# Altium project Driverkort.PrjPcb
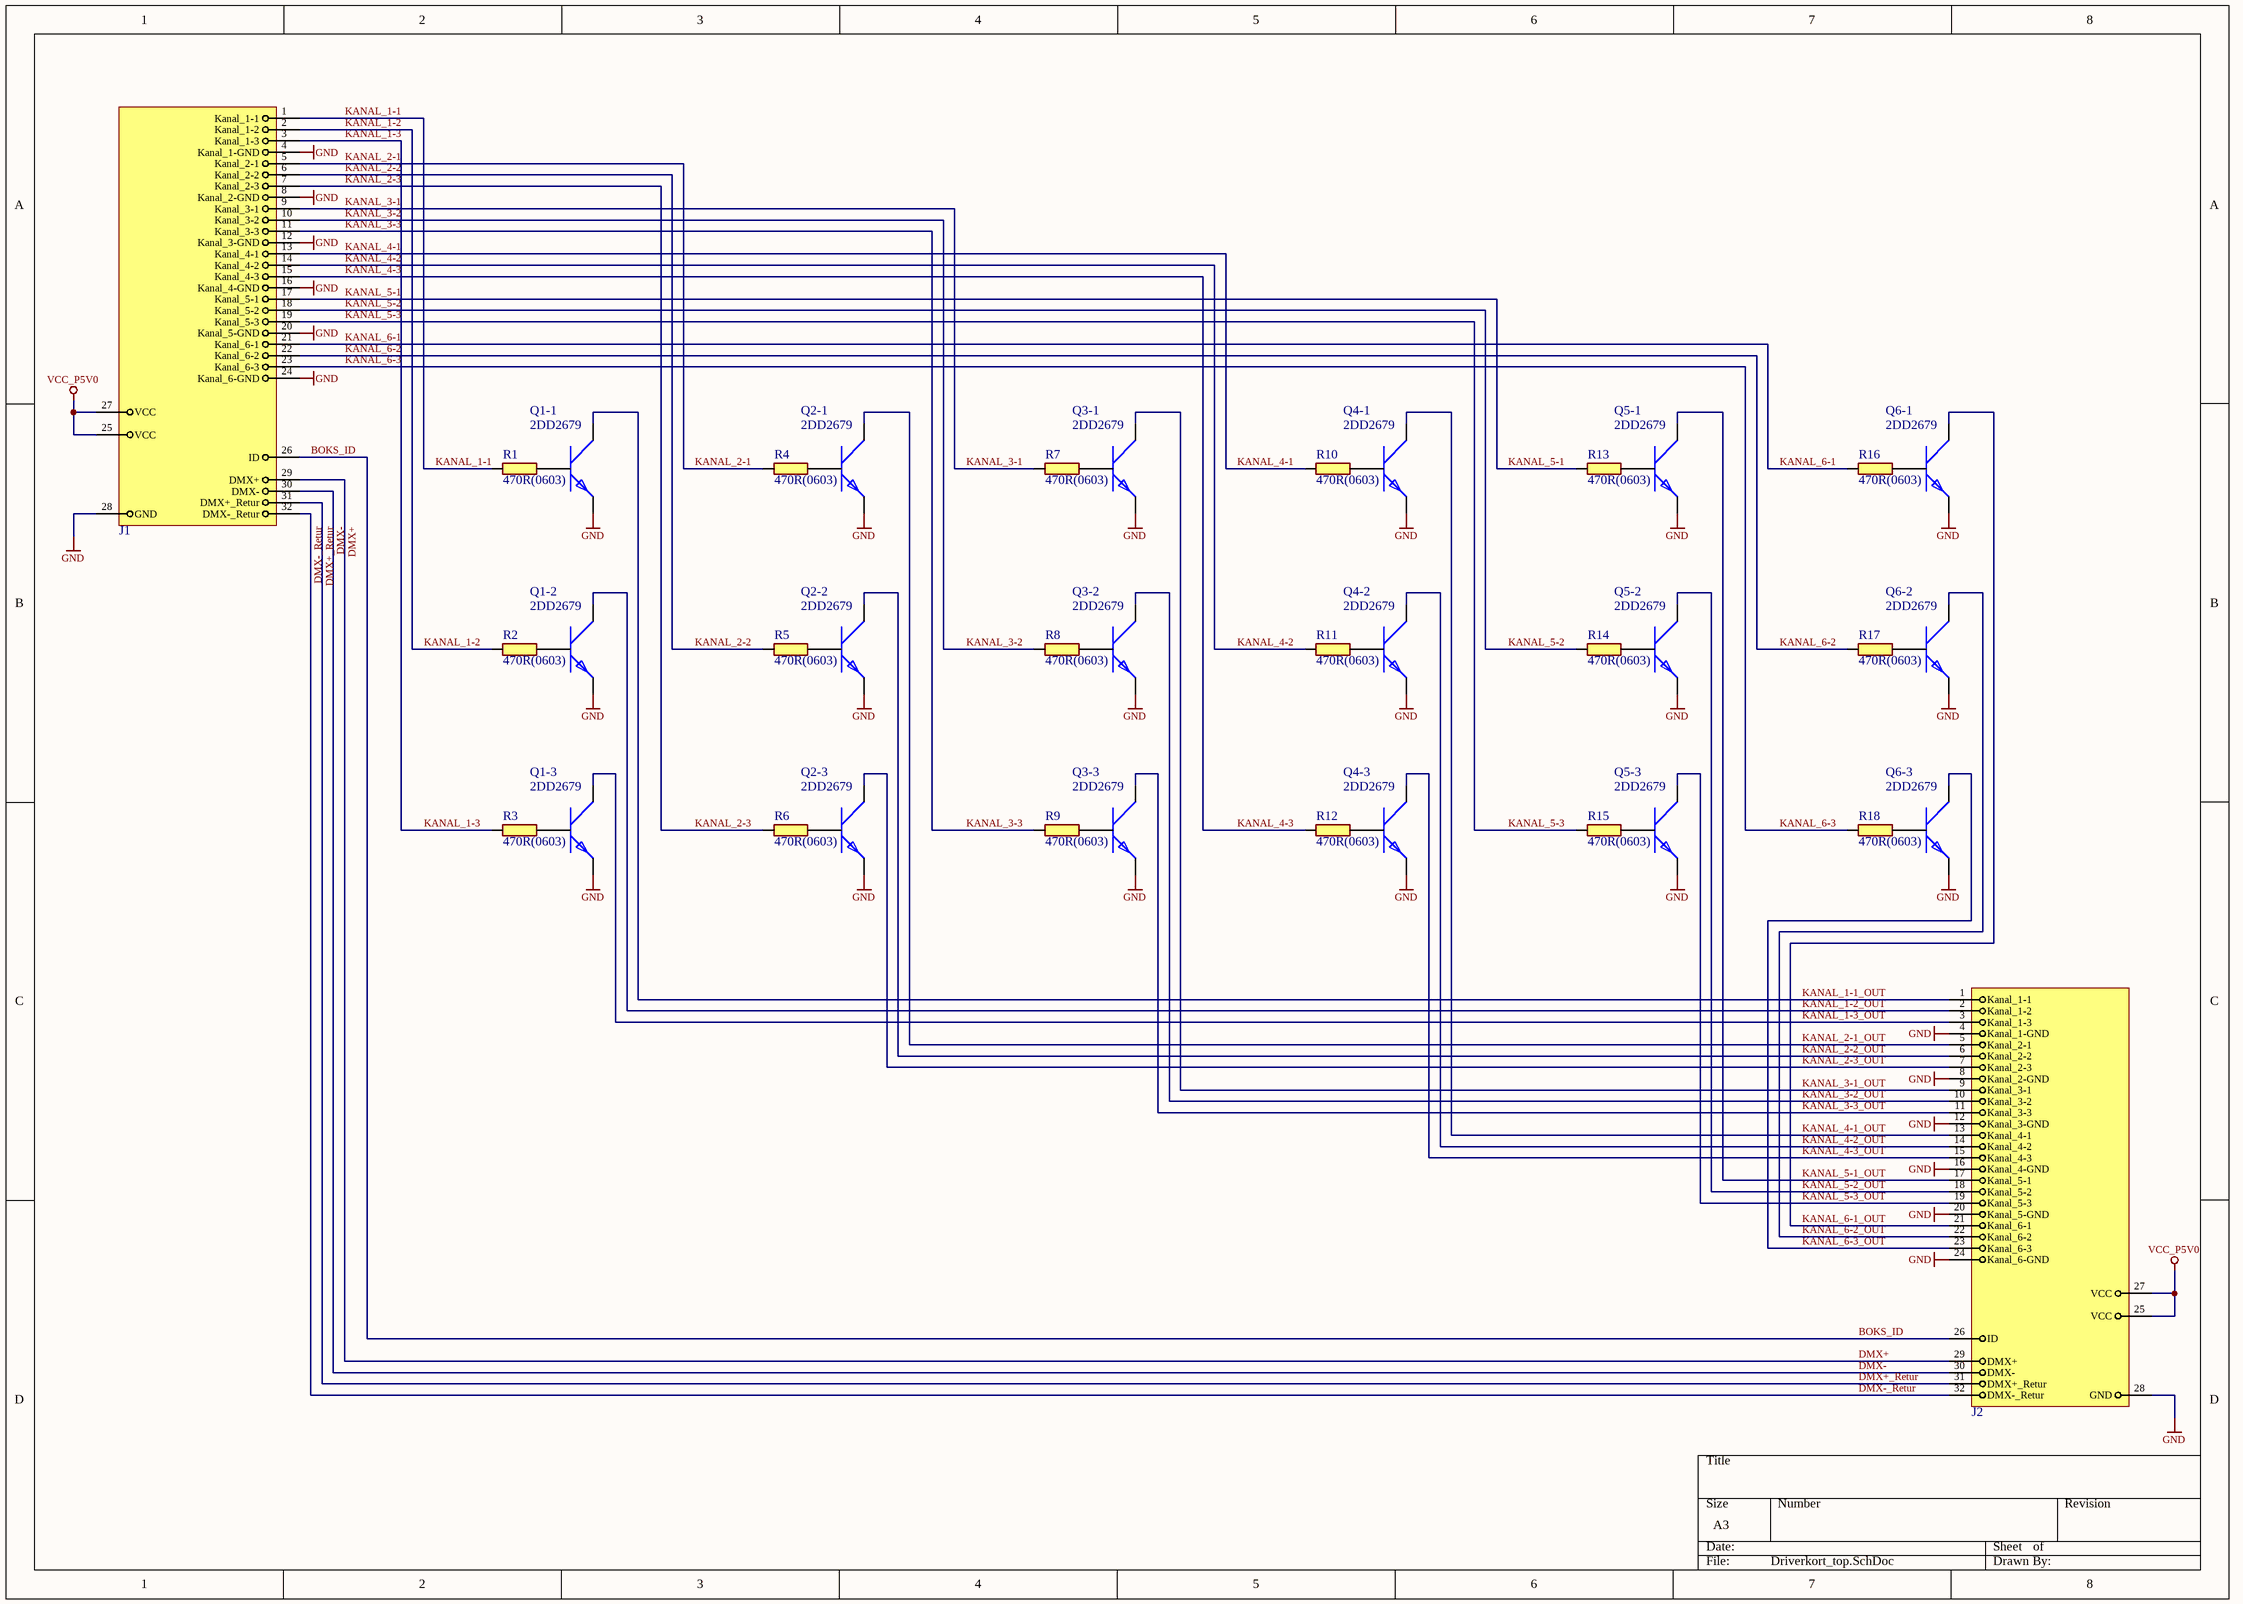
[diagram p0: Driverkort_top.SchDoc]
1 sheet, 38 parts. Net scope: global (net labels, ports and power ports of the same name join across sheets).
Board file: Driverkort.PcbDoc

## Sheet Driverkort_top.SchDoc
size A3

### Parts
J1  Lysreklameparalellbusskontakt2015_FEMALE  [HDRRAF32W64P254_2X16_4064X1260X600B]  (value not drawn)
J2  Lysreklameparalellbusskontakt2015  [HDRRA32W64P254_2X16_4064X1260X600B]  (value not drawn)
Q1-1  2DD2679  [SOT89-150P409X160-3N]
Q1-2  2DD2679  [SOT89-150P409X160-3N]
Q1-3  2DD2679  [SOT89-150P409X160-3N]
Q2-1  2DD2679  [SOT89-150P409X160-3N]
Q2-2  2DD2679  [SOT89-150P409X160-3N]
Q2-3  2DD2679  [SOT89-150P409X160-3N]
Q3-1  2DD2679  [SOT89-150P409X160-3N]
Q3-2  2DD2679  [SOT89-150P409X160-3N]
Q3-3  2DD2679  [SOT89-150P409X160-3N]
Q4-1  2DD2679  [SOT89-150P409X160-3N]
Q4-2  2DD2679  [SOT89-150P409X160-3N]
Q4-3  2DD2679  [SOT89-150P409X160-3N]
Q5-1  2DD2679  [SOT89-150P409X160-3N]
Q5-2  2DD2679  [SOT89-150P409X160-3N]
Q5-3  2DD2679  [SOT89-150P409X160-3N]
Q6-1  2DD2679  [SOT89-150P409X160-3N]
Q6-2  2DD2679  [SOT89-150P409X160-3N]
Q6-3  2DD2679  [SOT89-150P409X160-3N]
R1  470R(0603)  [RESC0603(1608)_N]
R2  470R(0603)  [RESC0603(1608)_N]
R3  470R(0603)  [RESC0603(1608)_N]
R4  470R(0603)  [RESC0603(1608)_N]
R5  470R(0603)  [RESC0603(1608)_N]
R6  470R(0603)  [RESC0603(1608)_N]
R7  470R(0603)  [RESC0603(1608)_N]
R8  470R(0603)  [RESC0603(1608)_N]
R9  470R(0603)  [RESC0603(1608)_N]
R10  470R(0603)  [RESC0603(1608)_N]
R11  470R(0603)  [RESC0603(1608)_N]
R12  470R(0603)  [RESC0603(1608)_N]
R13  470R(0603)  [RESC0603(1608)_N]
R14  470R(0603)  [RESC0603(1608)_N]
R15  470R(0603)  [RESC0603(1608)_N]
R16  470R(0603)  [RESC0603(1608)_N]
R17  470R(0603)  [RESC0603(1608)_N]
R18  470R(0603)  [RESC0603(1608)_N]

### Nets
GND: J1.4(Kanal_1-GND) J1.8(Kanal_2-GND) J1.12(Kanal_3-GND) J1.16(Kanal_4-GND) J1.20(Kanal_5-GND) J1.24(Kanal_6-GND) J1.28(GND) J2.4(Kanal_1-GND) J2.8(Kanal_2-GND) J2.12(Kanal_3-GND) J2.16(Kanal_4-GND) J2.20(Kanal_5-GND) J2.24(Kanal_6-GND) J2.28(GND) Q1-1.3(E) Q1-2.3(E) Q1-3.3(E) Q2-1.3(E) Q2-2.3(E) Q2-3.3(E) Q3-1.3(E) Q3-2.3(E) Q3-3.3(E) Q4-1.3(E) Q4-2.3(E) Q4-3.3(E) Q5-1.3(E) Q5-2.3(E) Q5-3.3(E) Q6-1.3(E) Q6-2.3(E) Q6-3.3(E)
VCC_P5V0: J1.25(VCC) J1.27(VCC) J2.25(VCC) J2.27(VCC)
BOKS_ID: J1.26(ID) J2.26(ID)
DMX+: J1.29(DMX+) J2.29(DMX+)
DMX+_Retur: J1.31(DMX+_Retur) J2.31(DMX+_Retur)
DMX-: J1.30(DMX-) J2.30(DMX-)
DMX-_Retur: J1.32(DMX-_Retur) J2.32(DMX-_Retur)
KANAL_1-1: J1.1(Kanal_1-1) R1.1
KANAL_1-1_OUT: J2.1(Kanal_1-1) Q1-1.2(C)
KANAL_1-2: J1.2(Kanal_1-2) R2.1
KANAL_1-2_OUT: J2.2(Kanal_1-2) Q1-2.2(C)
KANAL_1-3: J1.3(Kanal_1-3) R3.1
KANAL_1-3_OUT: J2.3(Kanal_1-3) Q1-3.2(C)
KANAL_2-1: J1.5(Kanal_2-1) R4.1
KANAL_2-1_OUT: J2.5(Kanal_2-1) Q2-1.2(C)
KANAL_2-2: J1.6(Kanal_2-2) R5.1
KANAL_2-2_OUT: J2.6(Kanal_2-2) Q2-2.2(C)
KANAL_2-3: J1.7(Kanal_2-3) R6.1
KANAL_2-3_OUT: J2.7(Kanal_2-3) Q2-3.2(C)
KANAL_3-1: J1.9(Kanal_3-1) R7.1
KANAL_3-1_OUT: J2.9(Kanal_3-1) Q3-1.2(C)
KANAL_3-2: J1.10(Kanal_3-2) R8.1
KANAL_3-2_OUT: J2.10(Kanal_3-2) Q3-2.2(C)
KANAL_3-3: J1.11(Kanal_3-3) R9.1
KANAL_3-3_OUT: J2.11(Kanal_3-3) Q3-3.2(C)
KANAL_4-1: J1.13(Kanal_4-1) R10.1
KANAL_4-1_OUT: J2.13(Kanal_4-1) Q4-1.2(C)
KANAL_4-2: J1.14(Kanal_4-2) R11.1
KANAL_4-2_OUT: J2.14(Kanal_4-2) Q4-2.2(C)
KANAL_4-3: J1.15(Kanal_4-3) R12.1
KANAL_4-3_OUT: J2.15(Kanal_4-3) Q4-3.2(C)
KANAL_5-1: J1.17(Kanal_5-1) R13.1
KANAL_5-1_OUT: J2.17(Kanal_5-1) Q5-1.2(C)
KANAL_5-2: J1.18(Kanal_5-2) R14.1
KANAL_5-2_OUT: J2.18(Kanal_5-2) Q5-2.2(C)
KANAL_5-3: J1.19(Kanal_5-3) R15.1
KANAL_5-3_OUT: J2.19(Kanal_5-3) Q5-3.2(C)
KANAL_6-1: J1.21(Kanal_6-1) R16.1
KANAL_6-1_OUT: J2.21(Kanal_6-1) Q6-1.2(C)
KANAL_6-2: J1.22(Kanal_6-2) R17.1
KANAL_6-2_OUT: J2.22(Kanal_6-2) Q6-2.2(C)
KANAL_6-3: J1.23(Kanal_6-3) R18.1
KANAL_6-3_OUT: J2.23(Kanal_6-3) Q6-3.2(C)
NetQ1-1_1: Q1-1.1(B) R1.2
NetQ1-2_1: Q1-2.1(B) R2.2
NetQ1-3_1: Q1-3.1(B) R3.2
NetQ2-1_1: Q2-1.1(B) R4.2
NetQ2-2_1: Q2-2.1(B) R5.2
NetQ2-3_1: Q2-3.1(B) R6.2
NetQ3-1_1: Q3-1.1(B) R7.2
NetQ3-2_1: Q3-2.1(B) R8.2
NetQ3-3_1: Q3-3.1(B) R9.2
NetQ4-1_1: Q4-1.1(B) R10.2
NetQ4-2_1: Q4-2.1(B) R11.2
NetQ4-3_1: Q4-3.1(B) R12.2
NetQ5-1_1: Q5-1.1(B) R13.2
NetQ5-2_1: Q5-2.1(B) R14.2
NetQ5-3_1: Q5-3.1(B) R15.2
NetQ6-1_1: Q6-1.1(B) R16.2
NetQ6-2_1: Q6-2.1(B) R17.2
NetQ6-3_1: Q6-3.1(B) R18.2

### Library data of the parts
Q1-1-Q1-3 Q2-1-Q2-3 Q3-1-Q3-3 Q4-1-Q4-3 Q5-1-Q5-3 Q6-1-Q6-3 = 2DD2679: LOW VCE(SAT) NPN SURFACE MOUNT TRANSISTOR; pakke_opprettet_av: 815; leverandor_varenr: 1710681; pris: 4; pakketype: 77; produsent: Diodes; leverandor: Farnell; id: 3047; Status: New; navn: 2DD2679; pakke_opprettet: 07.05.2015 20:46:56; symbol_opprettet_av: 815; symbol_opprettet: 07.05.2015 21:04:46; nokkelord: NPN
R1-R18 = 3180: 470R 0603 0.1W 1% Thick film resistor; id: 3180; pakke_opprettet_av: 815; symbol_opprettet_av: oystesm; pris: 0; nokkelord: Resistor, Motstand; pakketype: 93; pakke_opprettet: 08.07.2014 21:15:30; symbol_opprettet: 08.07.2014 21:16:33; navn: 470R(0603)